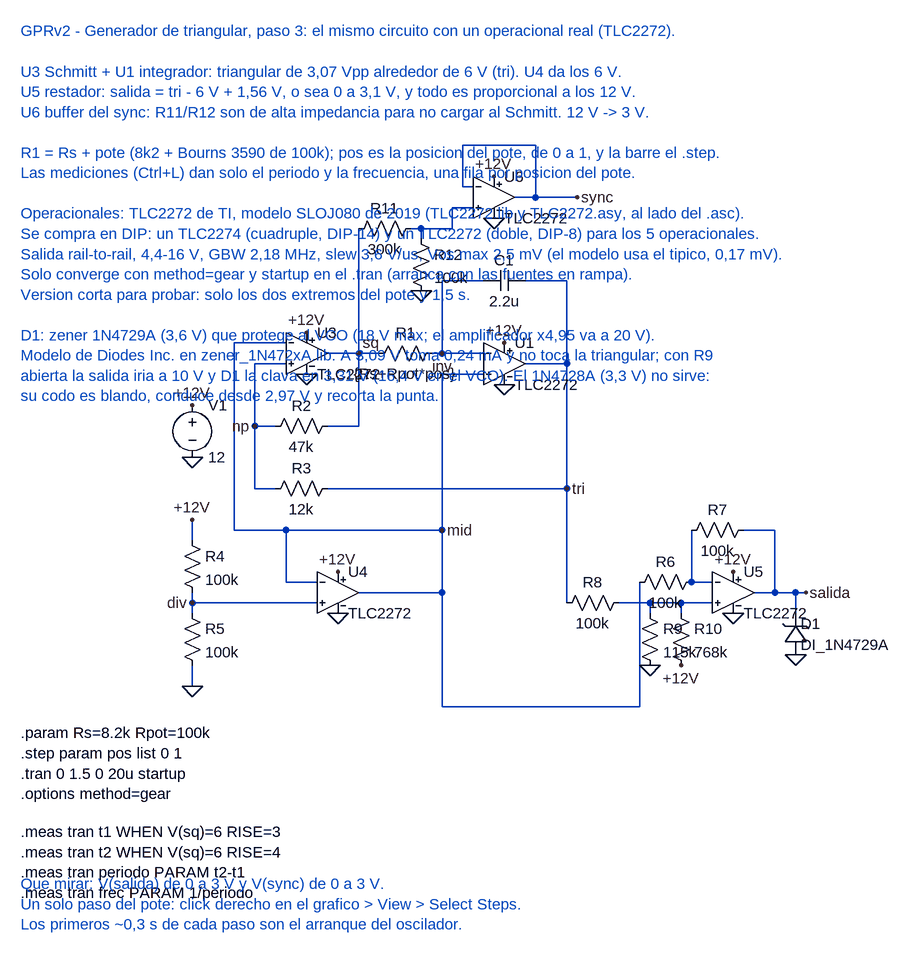
[diagram p0: schematic triangular3.asc]
triangular3.asc, the LTspice schematic file:
Version 4.1
SHEET 1 1800 1400
WIRE 352 -224 464 -224
WIRE 352 -160 352 -224
WIRE 368 -160 352 -160
WIRE 464 -144 464 -224
WIRE 464 -144 432 -144
WIRE 528 -144 464 -144
WIRE 336 -128 368 -128
WIRE 192 -96 192 96
WIRE 272 -96 288 -96
WIRE 288 -96 336 -96
WIRE 336 -96 336 -128
WIRE 288 -80 288 -96
WIRE 384 -16 320 -16
WIRE 512 -16 448 -16
WIRE 80 80 0 80
WIRE 192 96 144 96
WIRE 224 96 192 96
WIRE 320 96 320 -16
WIRE 320 96 304 96
WIRE 384 96 320 96
WIRE 80 112 32 112
WIRE 512 112 512 -16
WIRE 512 112 448 112
WIRE 384 128 320 128
WIRE 32 208 32 112
WIRE 64 208 32 208
WIRE 192 208 192 96
WIRE 192 208 144 208
WIRE 32 304 32 208
WIRE 64 304 32 304
WIRE 512 304 512 112
WIRE 512 304 144 304
WIRE 0 368 0 80
WIRE 80 368 0 368
WIRE 320 368 320 128
WIRE 320 368 80 368
WIRE 704 368 704 448
WIRE 784 368 832 368
WIRE -64 384 -64 352
WIRE 704 448 736 448
WIRE 80 448 80 368
WIRE 128 448 80 448
WIRE 320 464 320 368
WIRE 320 464 192 464
WIRE 832 464 832 368
WIRE 832 464 800 464
WIRE 864 464 832 464
WIRE 880 464 864 464
WIRE 864 496 864 464
WIRE 512 480 512 304
WIRE 592 480 640 480
WIRE 640 480 688 480
WIRE 688 480 736 480
WIRE -64 480 -64 464
WIRE 128 480 -64 480
WIRE 640 496 640 480
WIRE 688 496 688 480
WIRE -64 496 -64 480
WIRE -64 608 -64 576
WIRE 320 640 320 464
WIRE 624 640 320 640
WIRE 624 448 624 640
FLAG -64 256 0
FLAG -64 176 +12V
FLAG -64 608 0
FLAG 160 496 0
FLAG 112 128 0
FLAG 416 144 0
FLAG 112 64 +12V
FLAG 416 80 +12V
FLAG 160 432 +12V
FLAG -64 352 +12V
FLAG 192 96 sq
FLAG 32 208 np
FLAG 320 96 inv
FLAG 512 304 tri
FLAG 320 368 mid
FLAG -64 480 div
FLAG 288 0 0
FLAG 400 -176 +12V
FLAG 400 -112 0
FLAG 528 -144 sync
FLAG 640 576 0
FLAG 688 576 +12V
FLAG 768 432 +12V
FLAG 768 496 0
FLAG 880 464 salida
FLAG 864 560 0
SYMBOL res 320 80 R90
WINDOW 0 0 56 VBottom 2
WINDOW 3 32 56 VTop 2
SYMATTR InstName R1
SYMATTR Value {Rs+Rpot*pos}
SYMBOL cap 448 -32 R90
WINDOW 0 0 32 VBottom 2
WINDOW 3 32 32 VTop 2
SYMATTR InstName C1
SYMATTR Value 2.2u
SYMBOL res 160 192 R90
WINDOW 0 0 56 VBottom 2
WINDOW 3 32 56 VTop 2
SYMATTR InstName R2
SYMATTR Value 47k
SYMBOL res 160 288 R90
WINDOW 0 0 56 VBottom 2
WINDOW 3 32 56 VTop 2
SYMATTR InstName R3
SYMATTR Value 12k
SYMBOL voltage -64 160 R0
WINDOW 123 0 0 Left 0
WINDOW 39 0 0 Left 0
SYMATTR InstName V1
SYMATTR Value 12
SYMBOL res -80 368 R0
SYMATTR InstName R4
SYMATTR Value 100k
SYMBOL res -80 480 R0
SYMATTR InstName R5
SYMATTR Value 100k
SYMBOL TLC2272 416 112 R0
SYMATTR InstName U1
SYMBOL TLC2272 112 96 R0
SYMATTR InstName U3
SYMBOL TLC2272 160 464 R0
SYMATTR InstName U4
SYMBOL res 288 -112 R90
WINDOW 0 0 56 VBottom 2
WINDOW 3 32 56 VTop 2
SYMATTR InstName R11
SYMATTR Value 300k
SYMBOL res 272 -96 R0
SYMATTR InstName R12
SYMATTR Value 100k
SYMBOL TLC2272 400 -144 R0
SYMATTR InstName U6
SYMBOL res 608 464 R90
WINDOW 0 0 56 VBottom 2
WINDOW 3 32 56 VTop 2
SYMATTR InstName R8
SYMATTR Value 100k
SYMBOL res 624 480 R0
SYMATTR InstName R9
SYMATTR Value 115k
SYMBOL res 672 480 R0
SYMATTR InstName R10
SYMATTR Value 768k
SYMBOL res 720 432 R90
WINDOW 0 0 56 VBottom 2
WINDOW 3 32 56 VTop 2
SYMATTR InstName R6
SYMATTR Value 100k
SYMBOL res 800 352 R90
WINDOW 0 0 56 VBottom 2
WINDOW 3 32 56 VTop 2
SYMATTR InstName R7
SYMATTR Value 100k
SYMBOL TLC2272 768 464 R0
SYMATTR InstName U5
SYMBOL 1N4729A 848 496 R0
SYMATTR InstName D1
TEXT -328 -400 Left 2 ;GPRv2 - Generador de triangular, paso 3: el mismo circuito con un operacional real (TLC2272).\n\nU3 Schmitt + U1 integrador: triangular de 3,07 Vpp alrededor de 6 V (tri). U4 da los 6 V.\nU5 restador: salida = tri - 6 V + 1,56 V, o sea 0 a 3,1 V, y todo es proporcional a los 12 V.\nU6 buffer del sync: R11/R12 son de alta impedancia para no cargar al Schmitt. 12 V -> 3 V.\n\nR1 = Rs + pote (8k2 + Bourns 3590 de 100k); pos es la posicion del pote, de 0 a 1, y la barre el .step.\nLas mediciones (Ctrl+L) dan solo el periodo y la frecuencia, una fila por posicion del pote.\n\nOperacionales: TLC2272 de TI, modelo SLOJ080 de 2019 (TLC2272.lib y TLC2272.asy, al lado del .asc).\nSe compra en DIP: un TLC2274 (cuadruple, DIP-14) y un TLC2272 (doble, DIP-8) para los 5 operacionales.\nSalida rail-to-rail, 4,4-16 V, GBW 2,18 MHz, slew 3,6 V/us, Vos max 2,5 mV (el modelo usa el tipico, 0,17 mV).\nSolo converge con method=gear y startup en el .tran (arranca con las fuentes en rampa).\nVersion corta para probar: solo los dos extremos del pote y 1,5 s.\n\nD1: zener 1N4729A (3,6 V) que protege al VCO (18 V max; el amplificador x4,95 va a 20 V).\nModelo de Diodes Inc. en zener_1N472xA.lib. A 3,09 V toma 0,24 mA y no toca la triangular; con R9\nabierta la salida iria a 10 V y D1 la clava en 3,31 V (16,4 V en el VCO). El 1N4728A (3,3 V) no sirve:\nsu codo es blando, conduce desde 2,97 V y recorta la punta.
TEXT -328 680 Left 2 !.param Rs=8.2k Rpot=100k\n.step param pos list 0 1\n.tran 0 1.5 0 20u startup\n.options method=gear
TEXT -328 832 Left 2 !.meas tran t1 WHEN V(sq)=6 RISE=3\n.meas tran t2 WHEN V(sq)=6 RISE=4\n.meas tran periodo PARAM t2-t1\n.meas tran frec PARAM 1/periodo
TEXT -328 912 Left 2 ;Que mirar: V(salida) de 0 a 3 V y V(sync) de 0 a 3 V.\nUn solo paso del pote: click derecho en el grafico > View > Select Steps.\nLos primeros ~0,3 s de cada paso son el arranque del oscilador.

The netlist it stands for:
* triangular3.asc
R1 inv sq {Rs+Rpot*pos}
C1 tri inv 2.2u
R2 sq np 47k
R3 tri np 12k
V1 +12V 0 12
R4 +12V div 100k
R5 div 0 100k
X§U1 mid inv +12V 0 tri TLC2272  ; pins In+ In- V+ V- OUT
X§U3 np mid +12V 0 sq TLC2272  ; pins In+ In- V+ V- OUT
X§U4 div mid +12V 0 mid TLC2272  ; pins In+ In- V+ V- OUT
R11 N001 sq 300k
R12 N001 0 100k
X§U6 N001 sync +12V 0 sync TLC2272  ; pins In+ In- V+ V- OUT
R8 N003 tri 100k
R9 N003 0 115k
R10 N003 +12V 768k
R6 N002 mid 100k
R7 salida N002 100k
X§U5 N003 N002 +12V 0 salida TLC2272  ; pins In+ In- V+ V- OUT
X§D1 0 salida DI_1N4729A  ; pins A K
* GPRv2 - Generador de triangular, paso 3: el mismo circuito con un operacional real (TLC2272).
* U3 Schmitt + U1 integrador: triangular de 3,07 Vpp alrededor de 6 V (tri). U4 da los 6 V.
* U5 restador: salida = tri - 6 V + 1,56 V, o sea 0 a 3,1 V, y todo es proporcional a los 12 V.
* U6 buffer del sync: R11/R12 son de alta impedancia para no cargar al Schmitt. 12 V -> 3 V.
* R1 = Rs + pote (8k2 + Bourns 3590 de 100k); pos es la posicion del pote, de 0 a 1, y la barre el .step.
* Las mediciones (Ctrl+L) dan solo el periodo y la frecuencia, una fila por posicion del pote.
* Operacionales: TLC2272 de TI, modelo SLOJ080 de 2019 (TLC2272.lib y TLC2272.asy, al lado del .asc).
* Se compra en DIP: un TLC2274 (cuadruple, DIP-14) y un TLC2272 (doble, DIP-8) para los 5 operacionales.
* Salida rail-to-rail, 4,4-16 V, GBW 2,18 MHz, slew 3,6 V/us, Vos max 2,5 mV (el modelo usa el tipico, 0,17 mV).
* Solo converge con method=gear y startup en el .tran (arranca con las fuentes en rampa).
* Version corta para probar: solo los dos extremos del pote y 1,5 s.
* D1: zener 1N4729A (3,6 V) que protege al VCO (18 V max; el amplificador x4,95 va a 20 V).
* Modelo de Diodes Inc. en zener_1N472xA.lib. A 3,09 V toma 0,24 mA y no toca la triangular; con R9
* abierta la salida iria a 10 V y D1 la clava en 3,31 V (16,4 V en el VCO). El 1N4728A (3,3 V) no sirve:
* su codo es blando, conduce desde 2,97 V y recorta la punta.
.param Rs=8.2k Rpot=100k
.step param pos list 0 1
.tran 0 1.5 0 20u startup
.options method=gear
.meas tran t1 WHEN V(sq)=6 RISE=3
.meas tran t2 WHEN V(sq)=6 RISE=4
.meas tran periodo PARAM t2-t1
.meas tran frec PARAM 1/periodo
* Que mirar: V(salida) de 0 a 3 V y V(sync) de 0 a 3 V.
* Un solo paso del pote: click derecho en el grafico > View > Select Steps.
* Los primeros ~0,3 s de cada paso son el arranque del oscilador.
.lib TLC2272.lib
.lib zener_1N472xA.lib
.backanno
.end